# Altium schematic sheet DC Converter.SchDoc
size A4; Date: 2026/04/16; ApprovedBy: NA; Author: 邱上峯; CompanyName: JFM常裕富士機工; Engineer: 邱上峯; Revision: V1.0; SheetNumber: 7; SheetTotal: 8; Pcb Name: NA
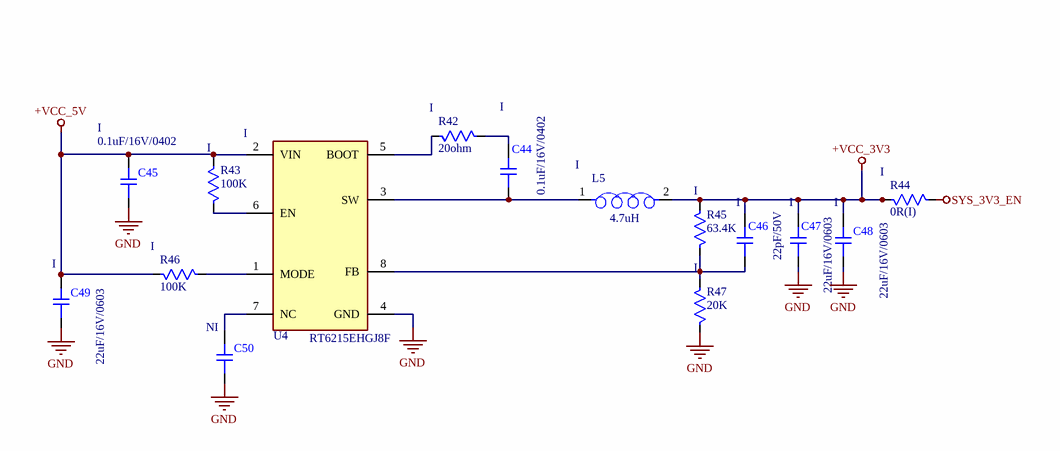
[diagram p0: DC Converter.SchDoc]

## Parts
C44  0.1uF/16V/0402  BOM: I  [C0402]
C45  0.1uF/16V/0402  BOM: I  [C0402]
C46  22pF/50V  BOM: I  [C0402]
C47  22uF/16V/0603  BOM: I  [C0603]
C48  22uF/16V/0603  BOM: I  [C0603]
C49  22uF/16V/0603  BOM: I  [C0603]
C50  NI  [C0402]
L5  4.7uH  BOM: I  [IND-HPI0402]
R42  20ohm  BOM: I  [R0402]
R43  100K  BOM: I  [R0402]
R44  0R(I)  BOM: I  [R0402]
R45  63.4K  BOM: I  [R0603]
R46  100K  BOM: I  [R0402]
R47  20K  BOM: I  [R0603]
U4  RT6215EHGJ8F  BOM: I  [SOT65P280X100-8N]

## Nets
+VCC_3V3: C46.2 C47.2 C48.2 L5.2 R44.1 R45.1
+VCC_5V: C45.2 C49.2 R43.2 R46.2 U4.2(VIN)
GND: C45.1 C47.1 C48.1 C49.1 C50.1 R47.2 U4.4(GND)
SYS_3V3_EN: R44.2
NetC44_1: C44.1 L5.1 U4.3(SW)
NetC44_2: C44.2 R42.1
NetC46_1: C46.1 R45.2 R47.1 U4.8(FB)
NetC50_2: C50.2 U4.7(NC)
NetR42_2: R42.2 U4.5(BOOT)
NetR43_1: R43.1 U4.6(EN)
NetR46_1: R46.1 U4.1(MODE)

## Notes on the sheet
- Title:
- Project:
- Date:
- Author:
- Revision:
- Engineer:
- Pcb Name:
- Sheet
- ApprovedBy:
- of

## Library data of the parts
C44-C49 = Cap
C50 = Cap: 3.9nF/16V; BOM: NI
L5 = INDUCTOR: 3L COILS/HPI0402-4R7M
R42-R47 = Res
U4 = RT6215EHGJ8F: DC/DC CONV, SYNC BUCK, 500KHZ, TSOT-23-8; Topology:Synchronous Buck (Step Down); Input Voltage Min:4.5V; Input Voltage Max:24V; No. of Outputs:1Outputs; DC / DC Converter IC Case:TSOT-23; No. of Pins:8Pins; Output Current:2A; Output RoHS Compliant: Yes; Manufacturer_Name: RICHTEK; Geometry.Height: 1mm; Mouser Part Number: *; Mouser Price/Stock: *; Manufacturer_Part_Number: RT6215EHGJ8F; Datasheet Link: https://componentsearchengine.com/Datasheets/2/RT6215EHGJ8F.pdf